# Altium schematic sheet [4] Half_Bridge.SchDoc
size A4; SheetNumber: 5; SheetTotal: 5
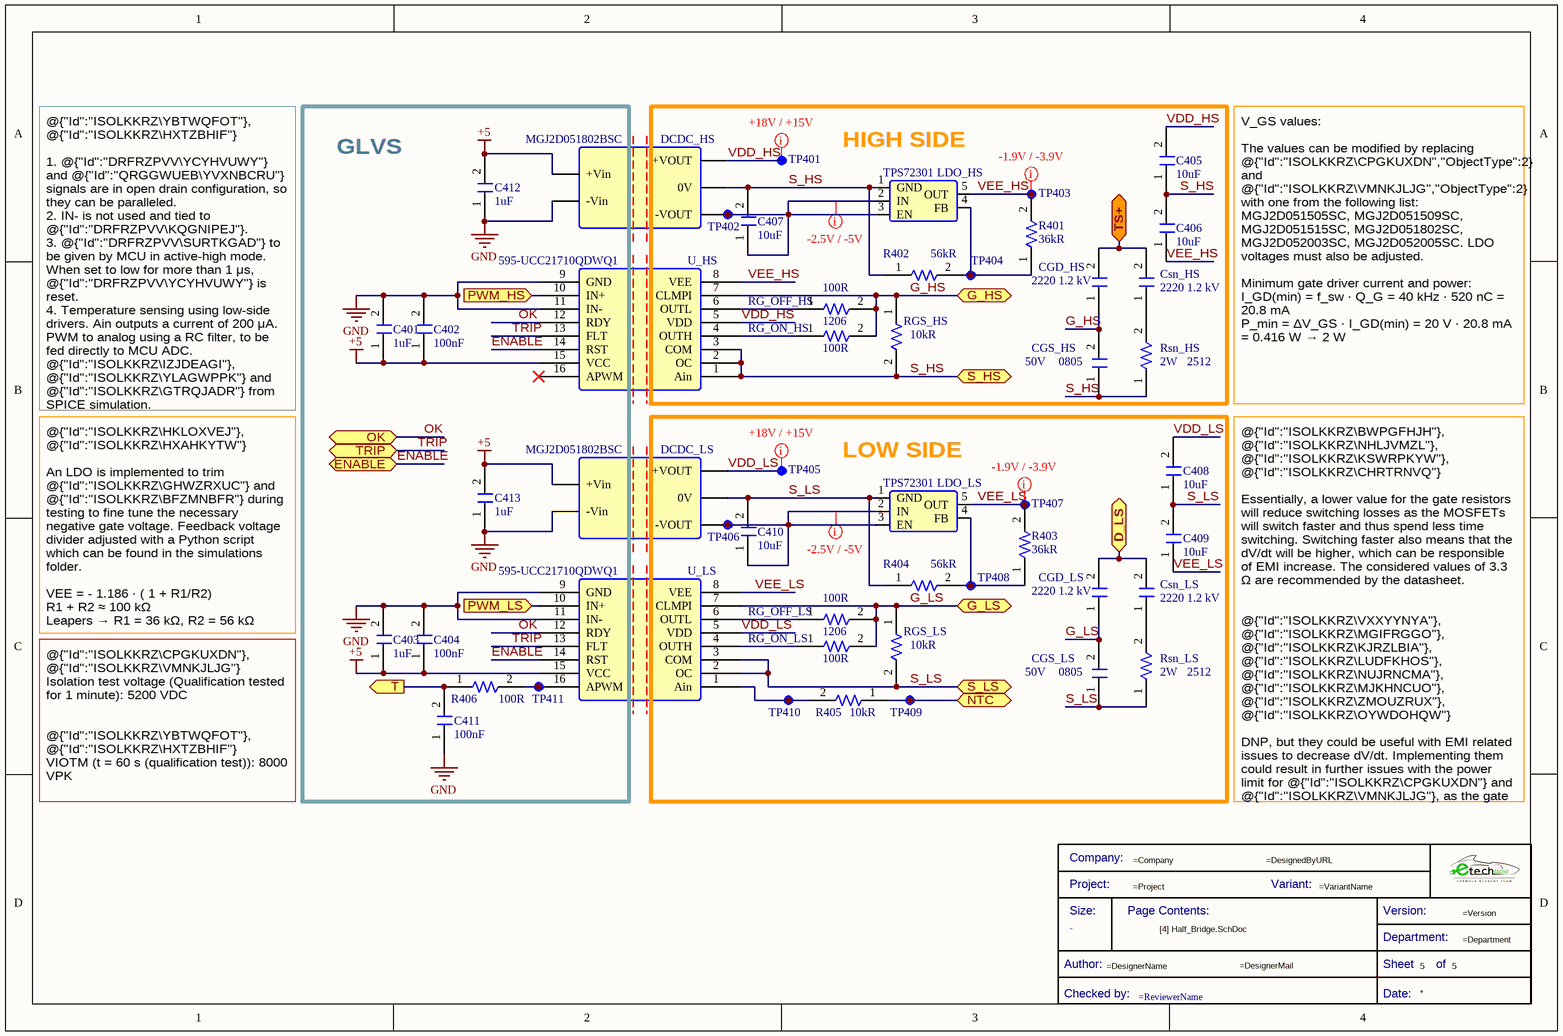
[diagram p0: [4] Half_Bridge.SchDoc]

## Parts
*?  Title Block_template  (value not drawn)  (graphical)
C401  Capacitance: 1uF  [C0805FNPC-R]  (hidden comment: 885012207103)
C402  Capacitance: 100nF  [C0805FNPC-R]  (hidden comment: 885012207098)
C403  Capacitance: 1uF  [C0805FNPC-R]  (hidden comment: 885012207103)
C404  Capacitance: 100nF  [C0805FNPC-R]  (hidden comment: 885012207098)
C405  10uF  [C0805FNPC-W]
C406  10uF  [C0805FNPC-W]
C407  10uF  [C0805FNPC-W]
C408  10uF  [C0805FNPC-W]
C409  10uF  [C0805FNPC-W]
C410  10uF  [C0805FNPC-W]
C411  Capacitance: 100nF  [C0805FNPC-R]  (hidden comment: 885012207098)
C412  Capacitance: 1uF  [C0805FNPC-R]  (hidden comment: 885012207103)
C413  Capacitance: 1uF  [C0805FNPC-R]  (hidden comment: 885012207103)
CGD_HS  Footprint: 2220  Voltage rating: 1.2 kV  [CAP_2220]  (hidden comment: C_2220)
CGD_LS  Footprint: 2220  Voltage rating: 1.2 kV  [CAP_2220]  (hidden comment: C_2220)
CGS_HS  Case/Package: 0805  Voltage Rating (DC): 50V  [C0805FNPC-W]  (hidden comment: 885012007057)
CGS_LS  Case/Package: 0805  Voltage Rating (DC): 50V  [C0805FNPC-W]  (hidden comment: 885012007057)
Csn_HS  Footprint: 2220  Voltage rating: 1.2 kV  [CAP_2220]  (hidden comment: C_2220)
Csn_LS  Footprint: 2220  Voltage rating: 1.2 kV  [CAP_2220]  (hidden comment: C_2220)
DCDC_HS  MGJ6-series  [MGJ2D051802BSC]  (value not drawn)
DCDC_LS  MGJ6-series  [MGJ2D051802BSC]  (value not drawn)
LDO_HS  TPS72301  [DBV0005A]
LDO_LS  TPS72301  [DBV0005A]
R401  value 36kR  [R1206FTK-R]  (hidden comment: CR1206-JW-363ELF)
R402  value 56kR  [R1206FTK-R]  (hidden comment: CR1206-JW-563ELF)
R403  value 36kR  [R1206FTK-R]  (hidden comment: CR1206-JW-363ELF)
R404  value 56kR  [R1206FTK-R]  (hidden comment: CR1206-JW-563ELF)
R405  Resistance: 10kR  [R0805FTK]  (hidden comment: CR0805-JW-103ELF)
R406  Resistance: 100R  [R0805FTK]  (hidden comment: CR0805-FX-1000ELF)
RG_OFF_HS  Case/Package: 1206  Resistance: 100R  [R1206FTK-W]  (hidden comment: CRG1206F100R)
RG_OFF_LS  Case/Package: 1206  Resistance: 100R  [R1206FTK-W]  (hidden comment: CRG1206F100R)
RG_ON_HS  Resistance: 100R  [R1206FTK-W]  (hidden comment: CRG1206F100R)
RG_ON_LS  Resistance: 100R  [R1206FTK-W]  (hidden comment: CRG1206F100R)
RGS_HS  Resistance: 10kR  [R0805FTK]  (hidden comment: CR0805-JW-103ELF)
RGS_LS  Resistance: 10kR  [R0805FTK]  (hidden comment: CR0805-JW-103ELF)
Rsn_HS  Case/Package: 2512  Max Power Dissipation: 2W  [R2512FTK]  (hidden comment: 352115RFT)
Rsn_LS  Case/Package: 2512  Max Power Dissipation: 2W  [R2512FTK]  (hidden comment: 352115RFT)
TP401  TestPoint  [TestPoint]  (value not drawn)  (no BOM)
TP402  TestPoint  [TestPoint]  (value not drawn)  (no BOM)
TP403  TestPoint  [TestPoint]  (value not drawn)  (no BOM)
TP404  TestPoint  [TestPoint]  (value not drawn)  (no BOM)
TP405  TestPoint  [TestPoint]  (value not drawn)  (no BOM)
TP406  TestPoint  [TestPoint]  (value not drawn)  (no BOM)
TP407  TestPoint  [TestPoint]  (value not drawn)  (no BOM)
TP408  TestPoint  [TestPoint]  (value not drawn)  (no BOM)
TP409  TestPoint  [TestPoint]  (value not drawn)  (no BOM)
TP410  TestPoint  [TestPoint]  (value not drawn)  (no BOM)
TP411  TestPoint  [TestPoint]  (value not drawn)  (no BOM)
U_HS  Supplier Part Number 1: 595-UCC21710QDWQ1  [FP-DW0016B-IPC_A]  (hidden comment: UCC21710)
U_LS  Supplier Part Number 1: 595-UCC21710QDWQ1  [FP-DW0016B-IPC_A]  (hidden comment: UCC21710)

## Blocks framed on the sheet
GLVS: C401-C404 C411-C413 R406 TP411
HIGH SIDE: C405-C407 CGD_HS CGS_HS Csn_HS DCDC_HS LDO_HS R401 R402 RG_OFF_HS RG_ON_HS RGS_HS Rsn_HS TP401-TP404
LOW SIDE: C408-C410 CGD_LS CGS_LS Csn_LS DCDC_LS LDO_LS R403-R405 RG_OFF_LS RG_ON_LS RGS_LS Rsn_LS TP405-TP410

## Ports
D_LS (bidir, see [3] Gate_Drivers[1C]), ENABLE (bidir, see [3] Gate_Drivers[1C], [3] Gate_Drivers[1A]), G_HS (bidir, see [3] Gate_Drivers[1C]), G_LS (bidir, see [3] Gate_Drivers[1C]), NTC (bidir, see [3] Gate_Drivers[1C]), OK (bidir, see [3] Gate_Drivers[1C]), PWM_HS (in, see [3] Gate_Drivers[1C]), PWM_LS (in, see [3] Gate_Drivers[1C]), S_HS (bidir, see [3] Gate_Drivers[1C]), S_LS (bidir, see [3] Gate_Drivers[1C]), T (out, see [3] Gate_Drivers[1C]), TRIP (bidir, see [3] Gate_Drivers[1C], [3] Gate_Drivers[1A]), TS+ (bidir, see [3] Gate_Drivers[1C], [1] Power_Stage[3B], [5] DC[1D])

## Nets
+5: C401.1 C402.1 C403.1 C404.1 C412.2 C413.2 DCDC_HS.1(+Vin) DCDC_LS.1(+Vin) U_HS.15(VCC) U_LS.15(VCC)
GND: C401.2 C402.2 C403.2 C404.2 C411.1 C412.1 C413.1 DCDC_HS.2(-Vin) DCDC_LS.2(-Vin) U_HS.9(GND) U_HS.11(IN-) U_LS.9(GND) U_LS.11(IN-)
D_LS: CGD_LS.2 Csn_LS.2 ; port D_LS
ENABLE: U_HS.14(RST) U_LS.14(RST) ; port ENABLE
G_HS: CGD_HS.1 CGS_HS.2 RG_OFF_HS.2 RG_ON_HS.2 RGS_HS.1 U_HS.7(CLMPI) ; port G_HS
G_LS: CGD_LS.1 CGS_LS.2 RG_OFF_LS.2 RG_ON_LS.2 RGS_LS.1 U_LS.7(CLMPI) ; port G_LS
NTC: R405.1 TP409.1(TP) ; port NTC
OK: U_HS.12(RDY) U_LS.12(RDY) ; port OK
PWM_HS: U_HS.10(IN+) ; port PWM_HS
PWM_LS: U_LS.10(IN+) ; port PWM_LS
S_HS: C405.1 C406.2 C407.2 CGS_HS.1 DCDC_HS.6(0V) LDO_HS.1(GND) R402.1 RGS_HS.2 Rsn_HS.1 U_HS.1(Ain) U_HS.2(OC) U_HS.3(COM) ; port S_HS
S_LS: C408.1 C409.2 C410.2 CGS_LS.1 DCDC_LS.6(0V) LDO_LS.1(GND) R404.1 RGS_LS.2 Rsn_LS.1 U_LS.2(OC) U_LS.3(COM) ; port S_LS
T: C411.2 R406.1 ; port T
TRIP: U_HS.13(FLT) U_LS.13(FLT) ; port TRIP
TS+: CGD_HS.2 Csn_HS.2 ; port TS+
VDD_HS: C405.2 DCDC_HS.7(+VOUT) TP401.1(TP) U_HS.5(VDD)
VDD_LS: C408.2 DCDC_LS.7(+VOUT) TP405.1(TP) U_LS.5(VDD)
VEE_HS: C406.1 LDO_HS.5(OUT) R401.2 TP403.1(TP) U_HS.8(VEE)
VEE_LS: C409.1 LDO_LS.5(OUT) R403.2 TP407.1(TP) U_LS.8(VEE)
NetC407_1: C407.1 DCDC_HS.5(-VOUT) LDO_HS.2(IN) LDO_HS.3(EN) TP402.1(TP)
NetC410_1: C410.1 DCDC_LS.5(-VOUT) LDO_LS.2(IN) LDO_LS.3(EN) TP406.1(TP)
NetCsn_HS_1: Csn_HS.1 Rsn_HS.2
NetCsn_LS_1: Csn_LS.1 Rsn_LS.2
NetLDO_HS_4: LDO_HS.4(FB) R401.1 R402.2 TP404.1(TP)
NetLDO_LS_4: LDO_LS.4(FB) R403.1 R404.2 TP408.1(TP)
NetR405_2: R405.2 TP410.1(TP) U_LS.1(Ain)
NetR406_2: R406.2 TP411.1(TP) U_LS.16(APWM)
NetRG_OFF_HS_1: RG_OFF_HS.1 U_HS.6(OUTL)
NetRG_OFF_LS_1: RG_OFF_LS.1 U_LS.6(OUTL)
NetRG_ON_HS_1: RG_ON_HS.1 U_HS.4(OUTH)
NetRG_ON_LS_1: RG_ON_LS.1 U_LS.4(OUTH)

Not connected (* = marked no-connect by the designer): U_HS 16(APWM)*

## Layout directives
mark named -1.9V / -3.9V: VEE_HS, VEE_LS
mark named +18V / +15V: VDD_HS, VDD_LS
mark named -2.5V / -5V: NetC407_1, NetC410_1

## Notes on the sheet
- @{"Id":"ISOLKKRZ\YBTWQFOT"}, @{"Id":"ISOLKKRZ\HXTZBHIF"}
  1. @{"Id":"DRFRZPVV\YCYHVUWY"} and @{"Id":"QRGGWUEB\YVXNBCRU"} signals are in open drain configuration, so they can be paralleled.
  2. IN- is not used and tied to @{"Id":"DRFRZPVV\KQGNIPEJ"}.
  3. @{"Id":"DRFRZPVV\SURTKGAD"} to be given by MCU in active-high mode. When set to low for more than 1 μs, @{"Id":"DRFRZPVV\YCYHVUWY"} is reset.
  4. Temperature sensing using low-side drivers. Ain outputs a current of 200 μA. PWM to analog using a RC filter, to be fed directly to MCU ADC. @{"Id":"ISOLKKRZ\IZJDEAGI"}, @{"Id":"ISOLKKRZ\YLAGWPPK"} and @{"Id":"ISOLKKRZ\GTRQJADR"} from SPICE simulation.
  5. Miller clamp protection is used.
  6. @{"Id":"ISOLKKRZ\DPSFKXAA"}, @{"Id":"ISOLKKRZ\TVXIRMYX"}: External gate pull-down is implemented even though the gate drivers implement an active pull-down.
  7. Overcurrent detection is not implemented.
- V_GS values:
  The values can be modified by replacing @{"Id":"ISOLKKRZ\CPGKUXDN","ObjectType":2}
  and @{"Id":"ISOLKKRZ\VMNKJLJG","ObjectType":2} with one from the following list: MGJ2D051505SC, MGJ2D051509SC, MGJ2D051515SC, MGJ2D051802SC, MGJ2D052003SC, MGJ2D052005SC. LDO voltages must also be adjusted.
  Minimum gate driver current and power:
  I_GD(min) = f_sw · Q_G = 40 kHz · 520 nC =
  20.8 mA
  P_min = ΔV_GS · I_GD(min) = 20 V · 20.8 mA = 0.416 W → 2 W
- @{"Id":"ISOLKKRZ\HKLOXVEJ"}, @{"Id":"ISOLKKRZ\HXAHKYTW"}
  An LDO is implemented to trim @{"Id":"ISOLKKRZ\GHWZRXUC"} and @{"Id":"ISOLKKRZ\BFZMNBFR"} during testing to fine tune the necessary negative gate voltage. Feedback voltage divider adjusted with a Python script which can be found in the simulations folder.
  VEE = - 1.186 · ( 1 + R1/R2)
  R1 + R2 ≈ 100 kΩ
  Leapers → R1 = 36 kΩ, R2 = 56 kΩ
  Wolfspeed → R1 = 68 kΩ, R2 = 30 kΩ
- @{"Id":"ISOLKKRZ\CPGKUXDN"}, @{"Id":"ISOLKKRZ\VMNKJLJG"}
  Isolation test voltage (Qualification tested for 1 minute): 5200 VDC
  @{"Id":"ISOLKKRZ\YBTWQFOT"}, @{"Id":"ISOLKKRZ\HXTZBHIF"}
  VIOTM (t = 60 s (qualification test)): 8000 VPK
- @{"Id":"ISOLKKRZ\BWPGFHJH"}, @{"Id":"ISOLKKRZ\NHLJVMZL"},
  @{"Id":"ISOLKKRZ\KSWRPKYW"}, @{"Id":"ISOLKKRZ\CHRTRNVQ"}
  Essentially, a lower value for the gate resistors will reduce switching losses as the MOSFETs will switch faster and thus spend less time switching. Switching faster also means that the dV/dt will be higher, which can be responsible of EMI increase. The considered values of 3.3 Ω are recommended by the datasheet.
  @{"Id":"ISOLKKRZ\VXXYYNYA"}, @{"Id":"ISOLKKRZ\MGIFRGGO"}, @{"Id":"ISOLKKRZ\KJRZLBIA"}, @{"Id":"ISOLKKRZ\LUDFKHOS"}, @{"Id":"ISOLKKRZ\NUJRNCMA"}, @{"Id":"ISOLKKRZ\MJKHNCUO"}, @{"Id":"ISOLKKRZ\ZMOUZRUX"}, @{"Id":"ISOLKKRZ\OYWDOHQW"}
  DNP, but they could be useful with EMI related issues to decrease dV/dt. Implementing them could result in further issues with the power limit for @{"Id":"ISOLKKRZ\CPGKUXDN"} and @{"Id":"ISOLKKRZ\VMNKJLJG"}, as the gate charge would increase significantly. The maximum allowed capacitance would be:
  CGS_max = 2 · P_DCDC / (ΔV_GS ^2 · f_sw) = 2 · 2 W / ((20 V)^2) · 40 kHz) = 250 nF
- (in symbol Title Block_template) Company:; Project:; Variant:; Size:; Page Contents:; Version:; Department:; Author:; Sheet; of; Checked by:; Date:

## Library data of the parts
*? = Title Block_template: Standard Title Block; .Creator: GP; Category: Title Block; .PCBcheck: GP; .SCHcheck: GP; Checked by:: =ReviewerName; Size: -
C401 C403 C412 C413 = C1u-50V-0805FNPC-X7R: Multilayer Ceramic Capacitor, Wcap-Csgp Series, 1 F, 10%, X7R, 50 V, 0805 [2012 Metric] Rohs Compliant: Yes; Manufacturer 1: Wurth Electronics; Voltage Rating: 50V; .Creator: GP; Supplier 1: RSComponents; Manufacturer Part Number 1: 885012207103; RoHS: Yes; Category: Ceramic Capacitors; Stock 1: 5100; Pricing 1: 50=0,27200, 250=0,25300, 500=0,22800, 1250=0,20100, 2500=0,17100 (GBP); Mount: Surface Mount; Case/Package: 0805; Case Code (Metric): 2012; Case Code (Imperial): 0805; Min Operating Temperature: -55°C; Max Operating Temperature: 85°C; Packaging: Cut Tape; Dielectric: X7R; Tolerance: 10%; Voltage Rating (DC): 50V; Length: 0.079inch; Width: 0.049inch; Thickness: 0.053inch; REACH SVHC: Unknown; RoHS Compliant: Yes; ComponentLink1URL: http://www.farnell.com/datasheets/1958501.pdf?src-supplier=Farnell; ComponentLink1Description: http://www.farnell.com/datasheets/1958501.pdf?src-supplier=Farnell; ComponentLink2URL: http://www.farnell.com/datasheets/1958501.pdf?src-supplier=Element14; ComponentLink2Description: http://www.farnell.com/datasheets/1958501.pdf?src-supplier=Element14; ComponentLink3URL: https://katalog.we-online.de/pbs/datasheet/885012107003.pdf?src-supplier=Digi-Key; ComponentLink3Description: https://katalog.we-online.de/pbs/datasheet/885012107003.pdf?src-supplier=Digi-Key; ComponentLink4URL: http://www.farnell.com/datasheets/1958501.pdf?src-supplier=Newark; ComponentLink4Description: http://www.farnell.com/datasheets/1958501.pdf?src-supplier=Newark; Supplier Part Number 1: 1813523
C402 C404 C411 = C100n-50V-0805FNPC-X7R: Cap, 0.1ΜF, 50V, 10%, X7R, 0805; Manufacturer 1: Wurth Electronics; .Creator: DR; Supplier 1: RSComponents; Manufacturer Part Number 1: 885012207098; RoHS: Yes; Category: Ceramic Capacitors; Stock 1: 8000; Pricing 1: 100=0,10200, 500=0,07100, 2000=0,06100 (GBP); Mount: Surface Mount; Case/Package: 0805; Case Code (Metric): 2012; Case Code (Imperial): 0805; Min Operating Temperature: -55°C; Max Operating Temperature: 125°C; Packaging: Cut Tape; Voltage Rating: 50V; Dielectric: X7R; Tolerance: 10%; Voltage Rating (DC): 50V; Length: 0.079inch; Width: 0.049inch; Thickness: 0.035inch; REACH SVHC: Unknown; RoHS Compliant: Yes; ComponentLink1URL: http://www.farnell.com/datasheets/1958498.pdf?src-supplier=Farnell; ComponentLink1Description: http://www.farnell.com/datasheets/1958498.pdf?src-supplier=Farnell; ComponentLink2URL: http://www.farnell.com/datasheets/1958498.pdf?src-supplier=Element14; ComponentLink2Description: http://www.farnell.com/datasheets/1958498.pdf?src-supplier=Element14; ComponentLink3URL: https://katalog.we-online.de/pbs/datasheet/885012207098.pdf?src-supplier=Digi-Key; ComponentLink3Description: https://katalog.we-online.de/pbs/datasheet/885012207098.pdf?src-supplier=Digi-Key; ComponentLink4URL: http://www.farnell.com/datasheets/1958498.pdf?src-supplier=Newark; ComponentLink4Description: http://www.farnell.com/datasheets/1958498.pdf?src-supplier=Newark; Supplier Part Number 1: 1813493
C405-C410 = C10uF-50V-0805FNPC
CGS_HS CGS_LS = C100p-50V-0805FNPC-C0G/NP0: Multilayer Ceramic Capacitor, Wcap-Csgp Series, 100 Pf, 5%, C0G / Np0, 50 V, 0805 [2012 Metric] Rohs Compliant: Yes; Manufacturer: Wurth Electronics; .Creator: DR; Capacitance: 100pF; Supplier 1: RSComponents; Manufacturer Part Number: 885012007057; RoHS: Yes; Category: Ceramic Capacitors; Stock 1: 1; Pricing 1: 4000=0,03900, 12000=0,03800 (USD); Mount: Surface Mount; Case Code (Metric): 2012; Case Code (Imperial): 0805; Min Operating Temperature: -55°C; Max Operating Temperature: 125°C; Packaging: Cut Tape; Voltage Rating: 50V; Dielectric: C0G; Tolerance: 5%; Length: 0.079inch; Width: 0.049inch; Thickness: 0.035inch; REACH SVHC: Unknown; RoHS Compliant: Yes; ComponentLink1URL: http://www.farnell.com/datasheets/1958443.pdf?src-supplier=Farnell; ComponentLink1Description: http://www.farnell.com/datasheets/1958443.pdf?src-supplier=Farnell; ComponentLink2URL: https://katalog.we-online.de/pbs/datasheet/885012007057.pdf?src-supplier=Digi-Key; ComponentLink2Description: https://katalog.we-online.de/pbs/datasheet/885012007057.pdf?src-supplier=Digi-Key; ComponentLink3URL: http://www.farnell.com/datasheets/1958443.pdf?src-supplier=Element14; ComponentLink3Description: http://www.farnell.com/datasheets/1958443.pdf?src-supplier=Element14; ComponentLink4URL: http://www.farnell.com/datasheets/1958443.pdf?src-supplier=Newark; ComponentLink4Description: http://www.farnell.com/datasheets/1958443.pdf?src-supplier=Newark; ComponentLink5Description: Where buy it; ComponentLink5URL: https://www.we-online.com/catalog/en/WCAP-CSGP-50VDC#885012007057; Supplier Part Number 1: 1813930
DCDC_HS DCDC_LS = MGJ2D051802BSC: Isolated DC/DC Converters - Through Hole DC/DC 2W TH 5-18/2V 5.4KV SIP; Manufacturer 1: Murata; Supplier 1: Avnet; Manufacturer Part Number 1: MGJ2D051802BSC; RoHS: No; Category: Board Mount Modules; Stock 1: 25; Pricing 1: 25=5,1192, 30=4,9896, 60=4,86, 130=4,7304, 250=4,6008, 1300=4,4712, 2500=4,3416 (USD); Supplier Part Number 1: MGJ2D051802BSC; Manufacturer Part Number: MGJ2D051802BSC
LDO_HS LDO_LS = TPS72301: 200-mA, negative, adjustable low-dropout voltage regulator with enable 5-SOT-23 -40 to 125; Manufacturer 1: Texas Instruments; Manufacturer Part Number 1: TPS72301DBVT; Supplier 1: Mouser; RoHS: Yes; Category: Voltage Regulators - Linear; Stock 1: 23139; Pricing 1: 1=3,59, 10=3,05, 50=3,05, 100=2,65, 1000=1,9, 10000=1,81 (USD); ComponentLink1URL: https://datasheet.ciiva.com/14280/tps72325-14280848.pdf?src-supplier=Avnet; ComponentLink1Description: https://datasheet.ciiva.com/14280/tps72325-14280848.pdf?src-supplier=Avnet; ComponentLink2URL: https://datasheet.ciiva.com/34301/1117366-34301992.pdf?src-supplier=Jameco; ComponentLink2Description: https://datasheet.ciiva.com/34301/1117366-34301992.pdf?src-supplier=Jameco; ComponentLink3URL: https://datasheet.ciiva.com/46395/1882773-46395194.pdf?src-supplier=Element14; ComponentLink3Description: https://datasheet.ciiva.com/46395/1882773-46395194.pdf?src-supplier=Element14; ComponentLink4URL: https://datasheet.ciiva.com/46397/1882773-46397514.pdf?src-supplier=Element14; ComponentLink4Description: https://datasheet.ciiva.com/46397/1882773-46397514.pdf?src-supplier=Element14; ComponentLink5URL: https://datasheet.ciiva.com/7993/1854117-7993002.pdf?src-supplier=Element14; ComponentLink5Description: https://datasheet.ciiva.com/7993/1854117-7993002.pdf?src-supplier=Element14; Supplier Part Number 1: 595-TPS72301DBVT
R401 R403 = R36k-1206FTK: Fixed Resistor, Metal Glaze/thick Film, 0.25W, 36000ohm, 200V, 5% +/-Tol, 200ppm/Cel, Surface Mount, 1206; Manufacturer: Bourns; Power: 250mW; Rated Temperature: 70°C; Temperature Coefficient: 200ppm/°C; Package Height: 0.6mm; Package Length: 3.2mm; Package Width: 1.6mm; Supplier: Digikey; Supplier Part Number: CR1206-JW-363ELF-ND; Manufacturer Part Number: CR1206-JW-363ELF; RoHS: Yes; Category: Chip SMD Resistors; Pricing: 25000=0,00763 (USD); Mounting Technology: Surface Mount; Pins: 2; Package Shape: Rectangular; Case/Package: 1206; Terminal Finish: Nickel; Min Operating Temperature: -55°C; Max Operating Temperature: 155°C; Tolerance: 5%; JESD-609 Code: e3; Resistor Type: FIXED RESISTOR; Construction: Chip; Package Style: SMTMeter; Packaging: Tape and Reel; Technology: RUTHENIUM OXIDE; Termination: Wraparound; Working Voltage: 200V; Reach SVHC Compliant: Yes; RoHS Compliant: Yes; ComponentLink1URL: https://datasheet.ciiva.com:443/pdfs/VipMasterIC/IC/BOUR/BOUR-S-A0009069624/BOUR-S-A0009069624-1.pdf?src-supplier=IHS+Markit; ComponentLink1Description: https://datasheet.ciiva.com:443/pdfs/VipMasterIC/IC/BOUR/BOUR-S-A0009069624/BOUR-S-A0009069624-1.pdf?src-supplier=IHS+Markit; ComponentLink2URL: https://datasheet.ciiva.com/9121/chpreztr-9121515.pdf?src-supplier=Avnet; ComponentLink2Description: https://datasheet.ciiva.com/9121/chpreztr-9121515.pdf?src-supplier=Avnet; ComponentLink3URL: https://datasheet.ciiva.com/5547/chpreztr-5547766.pdf?src-supplier=Mouser; ComponentLink3Description: https://datasheet.ciiva.com/5547/chpreztr-5547766.pdf?src-supplier=Mouser
R402 R404 = R56k-1206FTK: Fixed Resistor, Metal Glaze/thick Film, 0.25W, 56000ohm, 200V, 5% +/-Tol, 200ppm/Cel, Surface Mount, 1206; Manufacturer: Bourns; Power: 250mW; Rated Temperature: 70°C; Temperature Coefficient: 200ppm/°C; Package Height: 0.6mm; Package Length: 3.2mm; Package Width: 1.6mm; Supplier: Digikey; Supplier Part Number: 118-CR1206-JW-563ELFCT-ND; Manufacturer Part Number: CR1206-JW-563ELF; RoHS: Yes; Category: Chip SMD Resistors; Stock: 24380; Pricing: 1=0,1, 10=0,04, 50=0,0258, 100=0,0217, 500=0,01514, 1000=0,01317 (USD); Mounting Technology: Surface Mount; Pins: 2; Package Shape: Rectangular; Case/Package: 1206; Terminal Finish: Nickel; Min Operating Temperature: -55°C; Max Operating Temperature: 155°C; Tolerance: 5%; JESD-609 Code: e3; Resistor Type: FIXED RESISTOR; Construction: Chip; Package Style: SMTMeter; Packaging: Tape and Reel; Technology: RUTHENIUM OXIDE; Termination: Wraparound; Working Voltage: 200V; Reach SVHC Compliant: Yes; RoHS Compliant: Yes; ComponentLink1URL: https://datasheet.ciiva.com:443/pdfs/VipMasterIC/IC/BOUR/BOUR-S-A0009069624/BOUR-S-A0009069624-1.pdf?src-supplier=IHS+Markit; ComponentLink1Description: https://datasheet.ciiva.com:443/pdfs/VipMasterIC/IC/BOUR/BOUR-S-A0009069624/BOUR-S-A0009069624-1.pdf?src-supplier=IHS+Markit; ComponentLink2URL: https://datasheet.ciiva.com/5546/chpreztr-5546909.pdf?src-supplier=Mouser; ComponentLink2Description: https://datasheet.ciiva.com/5546/chpreztr-5546909.pdf?src-supplier=Mouser; ComponentLink3URL: https://datasheet.ciiva.com/9121/chpreztr-9121177.pdf?src-supplier=Avnet; ComponentLink3Description: https://datasheet.ciiva.com/9121/chpreztr-9121177.pdf?src-supplier=Avnet
R405 RGS_HS RGS_LS = R10k-0805FTK: BOURNS         CR0805-JW-103ELF            Surface Mount Chip Resistor, Thick Film, CR Series, 10 kohm, 125 mW,  5%, 150 V; Temperature Coefficient: 200ppm/°C; Power Rating: 125mW; Voltage Rating: 150V; Voltage Rating (DC): 100V; .Creator: DR; Supplier 1: Arrow Electronics; Manufacturer 1: Bourns; Manufacturer Part Number 1: CR0805-JW-103ELF; RoHS: Yes; Category: Chip SMD Resistors; Stock 1: 57566; Pricing 1: 1=0,05790, 10=0,01540, 25=0,01340, 100=0,00340 (USD); Mount: Surface Mount; Case/Package: 0805; Number of Pins: 2; Contact Plating: Tin; Case Code (Metric): 2012; Case Code (Imperial): 0805; Min Operating Temperature: -55°C; Max Operating Temperature: 155°C; Tolerance: 5%; Resistor Type: Thick Film; Package Quantity: 1; Packaging: Tape and Reel; Number of Terminations: 2; Termination: SMD/SMT; Max Power Dissipation: 125mW; Features: Moisture Resistant; Series: CR0805; Construction: Rectangular; Resistance Tolerance: 5%; Technology: THICK FILM; Length: 2mm; Width: 1.25mm; Height: 0.5mm; Depth: 1.25mm; Thickness: 508um; Radiation Hardening: No; REACH SVHC: No SVHC; Military Standard: Not; RoHS Compliant: Yes; ComponentLink1URL: https://datasheet.ciiva.com/11821/0900766b80fcdb72-11821135.pdf?src-supplier=RSComponents; ComponentLink1Description: https://datasheet.ciiva.com/11821/0900766b80fcdb72-11821135.pdf?src-supplier=RSComponents; ComponentLink2URL: https://datasheet.ciiva.com/9122/chpreztr-9122374.pdf?src-supplier=Avnet; ComponentLink2Description: https://datasheet.ciiva.com/9122/chpreztr-9122374.pdf?src-supplier=Avnet; ComponentLink3URL: https://datasheet.ciiva.com/22693/1902866-22693254.pdf?src-supplier=Element14; ComponentLink3Description: https://datasheet.ciiva.com/22693/1902866-22693254.pdf?src-supplier=Element14; ComponentLink4URL: https://datasheet.ciiva.com/7986/691949-7986187.pdf?src-supplier=Element14; ComponentLink4Description: https://datasheet.ciiva.com/7986/691949-7986187.pdf?src-supplier=Element14; ComponentLink5URL: https://datasheet.ciiva.com/30065/159chpreztr-30065976.pdf?src-supplier=Onlinecomponents.com; ComponentLink5Description: https://datasheet.ciiva.com/30065/159chpreztr-30065976.pdf?src-supplier=Onlinecomponents.com; ComponentLink6URL: https://datasheet.ciiva.com/16783/70154685-16783482.pdf?src-supplier=Allied+Electronics; ComponentLink6Description: https://datasheet.ciiva.com/16783/70154685-16783482.pdf?src-supplier=Allied+Electronics; ComponentLink7URL: https://datasheet.ciiva.com/5548/chpreztr-5548491.pdf?src-supplier=Mouser; ComponentLink7Description: https://datasheet.ciiva.com/5548/chpreztr-5548491.pdf?src-supplier=Mouser; ComponentLink8URL: https://datasheet.ciiva.com/6559/chpreztr-6559900.pdf?src-supplier=Digi-Key; ComponentLink8Description: https://datasheet.ciiva.com/6559/chpreztr-6559900.pdf?src-supplier=Digi-Key; ComponentLink9URL: https://datasheet.ciiva.com/6559/chpreztr-6559901.pdf?src-supplier=Digi-Key; ComponentLink9Description: https://datasheet.ciiva.com/6559/chpreztr-6559901.pdf?src-supplier=Digi-Key; ComponentLink10URL: https://datasheet.ciiva.com/7985/1856384-7985869.pdf?src-supplier=Element14; ComponentLink10Description: https://datasheet.ciiva.com/7985/1856384-7985869.pdf?src-supplier=Element14; ComponentLink11URL: https://datasheet.ciiva.com/48692/001055517-da-01-en-smd-wid-cr0805-jw-103elf-10k-ohm-1-8w-48692118.pdf?src-supplier=Conrad; ComponentLink11Description: https://datasheet.ciiva.com/48692/001055517-da-01-en-smd-wid-cr0805-jw-103elf-10k-ohm-1-8w-48692118.pdf?src-supplier=Conrad; Supplier Part Number 1: CR0805-JW-103ELF
R406 = R100-0805FTK: Res Thick Film 0805 100 Ohm 1% 1/8W ±100ppm/°C Molded SMD SMD Paper Tape on Plastic Reel; Manufacturer 1: Bourns; Power Rating: 125mW; Voltage Rating: 150V; .Creator: DR; Supplier 1: Arrow Electronics; Manufacturer Part Number 1: CR0805-FX-1000ELF; RoHS: Yes; Category: Chip SMD Resistors; Stock 1: 49802; Pricing 1: 1=0,05840, 10=0,03430, 25=0,01780, 100=0,00750, 250=0,00560, 500=0,00490, 3000=0,00470 (USD); Mount: Surface Mount; Case/Package: 0805; Number of Pins: 2; Contact Plating: Tin; Case Code (Imperial): 0805; Case Code (Metric): 2012; Min Operating Temperature: -55°C; Max Operating Temperature: 155°C; Tolerance: 1%; Resistor Type: Thick Film; Temperature Coefficient: 100ppm/°C; Packaging: Tape and Reel; Package Quantity: 1; Termination: SMD/SMT; Number of Terminations: 2; Max Power Dissipation: 125mW; Voltage Rating (DC): 150V; Features: Moisture Resistant; Series: CR0805; Resistance Tolerance: 1%; Construction: Rectangular; Technology: THICK FILM; Length: 2mm; Width: 1.25mm; Height: 0.5mm; Depth: 1.25mm; Thickness: 508um; Radiation Hardening: No; REACH SVHC: No SVHC; Military Standard: Not; RoHS Compliant: Yes; ComponentLink1URL: https://datasheet.ciiva.com/11809/0900766b80fcdb72-11809178.pdf?src-supplier=RSComponents; ComponentLink1Description: https://datasheet.ciiva.com/11809/0900766b80fcdb72-11809178.pdf?src-supplier=RSComponents; ComponentLink2URL: https://datasheet.ciiva.com/6547/chpreztr-6547413.pdf?src-supplier=Digi-Key; ComponentLink2Description: https://datasheet.ciiva.com/6547/chpreztr-6547413.pdf?src-supplier=Digi-Key; ComponentLink3URL: https://datasheet.ciiva.com/6547/chpreztr-6547414.pdf?src-supplier=Digi-Key; ComponentLink3Description: https://datasheet.ciiva.com/6547/chpreztr-6547414.pdf?src-supplier=Digi-Key; ComponentLink4URL: https://datasheet.ciiva.com/6547/chpreztr-6547415.pdf?src-supplier=Digi-Key; ComponentLink4Description: https://datasheet.ciiva.com/6547/chpreztr-6547415.pdf?src-supplier=Digi-Key; ComponentLink5URL: https://datasheet.ciiva.com/9120/chpreztr-9120744.pdf?src-supplier=Avnet; ComponentLink5Description: https://datasheet.ciiva.com/9120/chpreztr-9120744.pdf?src-supplier=Avnet; Supplier Part Number 1: CR0805-FX-1000ELF
RG_OFF_HS RG_OFF_LS RG_ON_HS RG_ON_LS = R100-1206FTK: Res Thick Film 1206 100 Ohm 1% 0.25W(1/4W) ±200ppm/C Pad SMD T/R; Manufacturer: TE Connectivity; Temperature Coefficient: 200ppm/°C; Max Power Dissipation: 250mW; Voltage Rating: 200V; Number of Resistors: 1; .Creator: AC; Category: Resistor; ComponentLink1Description: Datasheet; ComponentLink1URL: https://docs.rs-online.com/7aab/0900766b815b7339.pdf; ComponentLink2Description: Where buy it; ComponentLink2URL: https://es.rs-online.com/web/p/resistencias-de-montaje-en-superficie/2232120; Supplier 1: Digi-Key; Manufacturer Part Number: CRG1206F100R; RoHS: Yes; Stock 1: 13476; Pricing 1: 1=0,10000, 10=0,07600, 100=0,02920, 1000=0,01285, 2500=0,01110 (USD); Mount: Surface Mount; Case Code (Imperial): 1206; Case Code (Metric): 3216; Weight: 0.000571oz; Min Operating Temperature: -55°C; Max Operating Temperature: 125°C; Tolerance: 1%; Resistor Type: Thick Film; Packaging: Tape and Reel; Package Quantity: 5000; Number of Terminations: 2; Series: CRG, Neohm; Power Rating: 250mW; Termination: Solder; Technology: THICK FILM; Length: 3.1mm; Width: 1.55mm; Height: 0.55mm; Depth: 1.55mm; Radiation Hardening: No; RoHS Compliant: Yes; ELV: Compliant; ComponentLink3URL: https://datasheet.ciiva.com/11808/0900766b800a696e-11808648.pdf?src-supplier=RSComponents; ComponentLink3Description: https://datasheet.ciiva.com/11808/0900766b800a696e-11808648.pdf?src-supplier=RSComponents; ComponentLink4URL: https://datasheet.ciiva.com/16763/70063020-16763547.pdf?src-supplier=Allied+Electronics; ComponentLink4Description: https://datasheet.ciiva.com/16763/70063020-16763547.pdf?src-supplier=Allied+Electronics; ComponentLink5URL: https://datasheet.ciiva.com/5562/eng-ds-1773204-g-5562604.pdf?src-supplier=Mouser; ComponentLink5Description: https://datasheet.ciiva.com/5562/eng-ds-1773204-g-5562604.pdf?src-supplier=Mouser; Supplier Part Number 1: A106068CT-ND
  RG_ON_HS RG_ON_LS: Case/Package: 1206
Rsn_HS Rsn_LS = R15-2512FTK: Res Thick Film 2512 15 Ohm 1% 2W ±100ppm/C Pad SMD T/R; Manufacturer 1: TE Connectivity; Temperature Coefficient: 100ppm/°C; Voltage Rating: 250V; Number of Resistors: 1; .Creator: DR; Value: 15R; ComponentLink1Description: Datasheet; ComponentLink1URL: https://docs.rs-online.com/8bc1/0900766b81096b90.pdf; ComponentLink2Description: Where buy it; ComponentLink2URL: https://es.rs-online.com/web/p/resistencias-de-montaje-en-superficie/7551110; Supplier 1: RSComponents; Manufacturer Part Number 1: 352115RFT; RoHS: Yes; Category: Chip SMD Resistors; Stock 1: 1; Pricing 1: 10=0,64300, 250=0,62200, 1000=0,60000, 2000=0,55400, 2500=0,52100 (USD); Mount: Surface Mount; Case Code (Metric): 6432; Case Code (Imperial): 2512; Min Operating Temperature: -55°C; Max Operating Temperature: 155°C; Packaging: Tape and Reel; Tolerance: 1%; Resistor Type: Thick Film,Power resistor; Number of Terminations: 2; Termination: Solder; Voltage Rating (DC): 250V; Features: Automotive AEC-Q200; Series: 3521, CGS; Technology: THICK FILM; Resistance Tolerance: 1%; Length: 6.3mm; Height: 0.55mm; Depth: 3.2mm; RoHS Compliant: Yes; REACH SVHC: No SVHC; ELV: Compliant; ComponentLink3URL: https://datasheet.ciiva.com/25610/0900766b81096b90-25610033.pdf?src-supplier=RSComponents; ComponentLink3Description: https://datasheet.ciiva.com/25610/0900766b81096b90-25610033.pdf?src-supplier=RSComponents; ComponentLink4URL: https://datasheet.ciiva.com/46391/1610601-46391493.pdf?src-supplier=Element14; ComponentLink4Description: https://datasheet.ciiva.com/46391/1610601-46391493.pdf?src-supplier=Element14; ComponentLink5URL: https://datasheet.ciiva.com/7657/1610601-7657542.pdf?src-supplier=Element14; ComponentLink5Description: https://datasheet.ciiva.com/7657/1610601-7657542.pdf?src-supplier=Element14; Supplier Part Number 1: 7551110P
TP401-TP411 = TestPoint: Test Point 1x1 mm; .Creator: GP; Category: TestPoint; .PCBcheck: GP; .SCHcheck: GP
U_HS U_LS = UCC21710: Automotive ±10-A 5.7kV RMS single channel isolated gate driver for SiC/IGBT 16-SOIC -40 to 125; Manufacturer 1: Texas Instruments; Manufacturer Part Number 1: UCC21710QDWQ1; Supplier 1: Mouser; RoHS: Yes; Category: Gate Drivers; Stock 1: 3113; Pricing 1: 1=9,15, 10=8,27, 50=7,89, 100=7,89, 1000=5,3, 10000=5,3 (USD); ComponentLink1URL: http://www.ti.com/general/docs/suppproductinfo.tsp?distId=10&amp;gotoUrl=http%3A%2F%2Fwww.ti.com%2Flit%2Fgpn%2Fucc21710-q1&src-supplier=Digi-Key; ComponentLink1Description: http://www.ti.com/general/docs/suppproductinfo.tsp?distId=10&amp;gotoUrl=http%3A%2F%2Fwww.ti.com%2Flit%2Fgpn%2Fucc21710-q1&src-supplier=Digi-Key